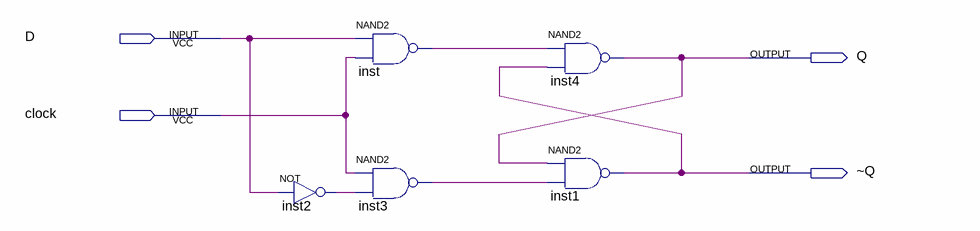
[diagram p0: schematic sheet]
// Quartus schematic lab09step2.bdf as structural Verilog: 5 symbols, 4 pins
module lab09step2 (
  input  D,
  input  clock,
  output Q,
  output \~Q 
);

  wire inst2_out, inst3_out, inst_out;

  not inst2 (inst2_out, D);
  nand inst (inst_out, D, clock);
  nand inst3 (inst3_out, clock, inst2_out);
  nand inst4 (Q, inst_out, \~Q );
  nand inst1 (\~Q , Q, inst3_out);
endmodule
